# Altium project LT-CHARGE+.PrjPcb
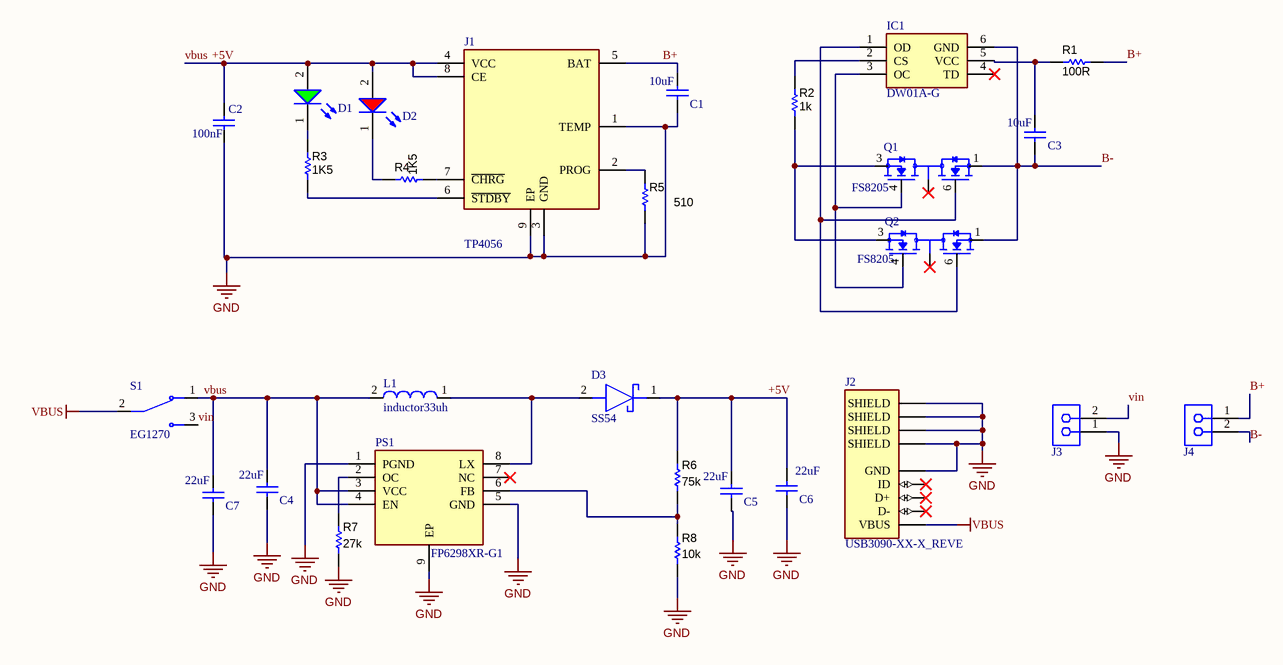
[diagram p0: LT-CHARGE+.SchDoc]
1 sheet, 28 parts. Net scope: global (net labels, ports and power ports of the same name join across sheets).
Board file: LT-CHARGE+.PcbDoc

## Sheet LT-CHARGE+.SchDoc
size A4; SheetNumber: 1; SheetTotal: 1

### Parts
C1  10uF  [WCAP-CSGP_0603_L1.6W0.8H0.8_Wave]
C2  100nF  [WCAP-CSGP_0603_L1.6W0.8H0.8_Wave]
C3  10uF  [WCAP-CSGP_0603_L1.6W0.8H0.8_Wave]
C4  22uF  [WCAP-CSGP_0805_L2W1.25H0.6_Wave]
C5  22uF  [WCAP-CSGP_0805_L2W1.25H0.6_Wave]
C6  22uF  [WCAP-CSGP_0805_L2W1.25H0.6_Wave]
C7  22uF  [WCAP-CSGP_0805_L2W1.25H0.6_Wave]
D1  Green, 3.1V, 120°  [WL-SMCD_0603]  (value not drawn)
D2  Super Red, 2V, 140°  [WL-SMCD_0603]  (value not drawn)
D3  SS54  [DIOM5026X262N]
IC1  DW01A-G  [SOT95P280X135-6N]
J1  TP4056  [SOIC127P600X175-9N]
J2  USB3090-XX-X_REVE  [GCT_USB3080-XX-01-A_REVE]
J3  691412220002M  [691210910002]  (value not drawn)
J4  691412220002M  [MOLEX_530480210]  (value not drawn)
L1  inductor33uh  [WE-PD_6050R]
PS1  FP6298XR-G1  [SOIC127P600X175-9N]
Q1  FS8205  [FS8205]
Q2  FS8205  [FS8205]
R1  ValueDisplayed: 100R  [0603L]  (hidden comment: ERA-3ARW103V)
R2  ValueDisplayed: 1k  [0603L]  (hidden comment: ERA-3ARW103V)
R3  value 1K5  [0402L]  (hidden comment: CRCW0402510RJNED)
R4  value 1K5  [0402L]  (hidden comment: CRCW0402510RJNED)
R5  value 510  [0402L]  (hidden comment: CRCW0402510RJNED)
R6  value 75k  [0402L]  (hidden comment: CRCW0402510RJNED)
R7  value 27k  [0402L]  (hidden comment: CRCW0402510RJNED)
R8  value 10k  [0402L]  (hidden comment: CRCW0402510RJNED)
S1  EG1270  [SW_EG1270]

### Nets
+5V: C2.2 C4.2 C5.2 C6.2 C7.2 D1.2(A) D2.2(A) D3.1(K) J1.4(VCC) J1.8(CE) J2.1(VBUS) L1.2 PS1.3(VCC) PS1.4(EN) R6.2 S1.1 S1.2  [also labelled VBUS]
GND: C1.1 C2.1 C4.1 C5.1 C6.1 C7.1 J1.1(TEMP) J1.3(GND) J1.9(EP) J2.5(GND) J2.6(SHIELD) J2.7(SHIELD) J2.8(SHIELD) J2.9(SHIELD) J3.1 PS1.1(PGND) PS1.5(GND) PS1.9(EP) R5.1 R7.1 R8.1
B+: C1.2 J1.5(BAT) J4.1 R1.2
B-: C3.1 IC1.6(GND) J4.2 Q1.1(S1) Q2.1(S1)
vin: J3.2 S1.3
NetC3_2: C3.2 IC1.5(VCC) R1.1
NetD1_1: D1.1(K) R3.2
NetD2_1: D2.1(K) R4.2
NetD3_2: D3.2(A) L1.1 PS1.8(LX)
NetIC1_1: IC1.1(OD) Q1.6(G1) Q2.6(G1)
NetIC1_2: IC1.2(CS) R2.2
NetIC1_3: IC1.3(OC) Q1.4(G2) Q2.4(G2)
NetJ1_2: J1.2(PROG) R5.2
NetJ1_6: J1.6(~{STDBY}) R3.1
NetJ1_7: J1.7(~{CHRG}) R4.1
NetPS1_2: PS1.2(OC) R7.2
NetPS1_6: PS1.6(FB) R6.1 R8.2
NetQ1_2: Q1.2(D12) Q1.5(D12)
NetQ1_3: Q1.3(S2) Q2.3(S2) R2.1
NetQ2_2: Q2.2(D12) Q2.5(D12)

Not connected (* = marked no-connect by the designer): IC1 4(TD)*; J2 2(D-)* 3(D+)* 4(ID)*; PS1 7(NC)*

### Library data of the parts
C1-C3 = C: WCAP-CSGP Multilayer Ceramic Chip Capacitor, General Purpose, size 0201, NP0 Class I, 100pF, 25VDC; Manufacturer Part Number: 885012004001; Manufacturer: Wurth Elektronik; Case/Size Code: 0201; Capacitance Tolerance: +/-5%; Insulation Resistance: 10GΩ; Q Factor: 1000; Rated Voltage (DC): 25V; Technical Reference: NP00201101J025DFCT10000; Category: Multilayer Ceramic Chip Capacitors; Match Code: WCAP-CSGP; ComponentLink1Description: Website Link; ComponentLink1URL: https://www.we-online.com/redexpert/article/885012004001?ad; ComponentLink2Description: Datasheet Link; ComponentLink2URL: https://www.we-online.com/redexpert/spec/885012004001?ad; Mount: Surface Mount; Operating Temperature Max: 125°C; Operating Temperature Min: -55°C; Packaging: Tape and Reel; Length: 0.6mm; Width: 0.3mm; Height: 0.3mm; Capacitance: 100pF; Ceramic Type: NP0 Class I
C4-C7 = C-08: WCAP-CSGP Multilayer Ceramic Chip Capacitor, General Purpose, size 0201, NP0 Class I, 10pF, 50VDC; Manufacturer Part Number: 885012004011; Manufacturer: Wurth Elektronik; Case/Size Code: 0201; Capacitance Tolerance: +/-5%; Insulation Resistance: 10GΩ; Q Factor: 600; Rated Voltage (DC): 50V; Technical Reference: NP00201100J050DFCT10000; Category: Multilayer Ceramic Chip Capacitors; Match Code: WCAP-CSGP; ComponentLink1Description: Website Link; ComponentLink1URL: https://www.we-online.com/redexpert/article/885012004011?ad; ComponentLink2Description: Datasheet Link; ComponentLink2URL: https://www.we-online.com/redexpert/spec/885012004011?ad; Mount: Surface Mount; Operating Temperature Max: 125°C; Operating Temperature Min: -55°C; Packaging: Tape and Reel; Length: 0.6mm; Width: 0.3mm; Height: 0.3mm; Capacitance: 10pF; Ceramic Type: NP0 Class I
D1 = led-green: WL-SMSW Mono-color Side View Waterclear, size 3014, Green, 3.1V, 120°; Manufacturer Part Number: 155301GS73100; Manufacturer: Wurth Elektronik; Case/Size Code: 3014; Chip Technology: InGaN; Dominant Wavelength: 525nm; Luminous Intensity: 1500mcd; Peak Wavelength: 515nm; Category: Signal LEDs; Match Code: WL-SMSW; ComponentLink1Description: Website Link; ComponentLink1URL: https://www.we-online.com/redexpert/article/155301GS73100?ad; ComponentLink2Description: Datasheet Link; ComponentLink2URL: https://www.we-online.com/redexpert/spec/155301GS73100?ad; Mount: Surface Mount; Operating Temperature Max: 85°C; Operating Temperature Min: -40°C; Packaging: Tape and Reel; Length: 3mm; Width: 1.38mm; Height: 1.55mm; Emitting Color: Green; Forward Voltage: 3.1V; Viewing Angle: 120°
D2 = led-red: WL-SMCD Mono-color Chip LED Diffused, SMT, size 0603, Super Red, 2V, 140°; Manufacturer Part Number: 150060SS55040; Manufacturer: Wurth Elektronik; Case/Size Code: 0603; Chip Technology: AlInGaP; Dominant Wavelength: 630nm; Luminous Intensity: 70mcd; Peak Wavelength: 645nm; Category: Signal LEDs; Match Code: WL-SMCD; ComponentLink1Description: Website Link; ComponentLink1URL: https://www.we-online.com/redexpert/article/150060SS55040?ad; ComponentLink2Description: Datasheet Link; ComponentLink2URL: https://www.we-online.com/redexpert/spec/150060SS55040?ad; Mount: Surface Mount; Operating Temperature Max: 85°C; Operating Temperature Min: -40°C; Packaging: Tape and Reel; Length: 1.6mm; Width: 0.8mm; Height: 0.4mm; Emitting Color: Super Red; Forward Voltage: 2V; Viewing Angle: 140°
D3 = SS54: Schottky Diode; Manufacturer_Name: DIYI Elec Tech; Datasheet Link: https://datasheet.lcsc.com/szlcsc/DIYI-Elec-Tech-SS54_C84165.pdf; Height: 2.62mm; Manufacturer_Part_Number: SS54
IC1 = DW01A-G: Integrated Circuit; Manufacturer_Name: Fortune Semiconductor Corporation; Datasheet Link: http://acoptex.com/uploads/DW01A.pdf; Height: 1.35mm; Manufacturer_Part_Number: DW01A-G
J1 = TP4056: Connector; Manufacturer_Name: NanJing Top Power; Datasheet Link: https://dlnmh9ip6v2uc.cloudfront.net/datasheets/Prototyping/TP4056.pdf; Height: 1.75mm; Manufacturer_Part_Number: TP4056
J2 = USB3090-XX-X_REVE: Micro USB Receptacle, Type AB, SMT, R/A, Bottom Mount, w/out Peg, w/outer shell stakes; Package: None; Price: None; Value: *; MP: USB3090-XX-X_REVE; Availability: Unavailable
J3 = conn: WR-TBL Series 4122M 45° Entry, THT, pitch 7mm, 2p; Manufacturer: Wurth Elektronik; Modularity: No; Rated Current: 4A; Working Voltage: 300V; ComponentLink1Description: Website Link; ComponentLink1URL: https://www.we-online.com/redexpert/article/691412220002M?ad; ComponentLink2Description: Datasheet Link; ComponentLink2URL: https://www.we-online.com/redexpert/spec/691412220002M?ad; Manufacturer Part Number: 691412220002M; Category: Terminal Blocks; Match Code: WR-TBL; Mount: Through Hole; Operating Temperature Max: 120°C; Operating Temperature Min: -30°C; Packaging: Box; Application: Screwless; Number of Pins: 2; Number of Rows: 1; Orientation: 45°; Pitch: 7mm
J4 = header: WR-TBL Series 4122M 45° Entry, THT, pitch 7mm, 2p; Manufacturer: Wurth Elektronik; Modularity: No; Rated Current: 4A; Working Voltage: 300V; ComponentLink1Description: Website Link; ComponentLink1URL: https://www.we-online.com/redexpert/article/691412220002M?ad; ComponentLink2Description: Datasheet Link; ComponentLink2URL: https://www.we-online.com/redexpert/spec/691412220002M?ad; Manufacturer Part Number: 691412220002M; Category: Terminal Blocks; Match Code: WR-TBL; Mount: Through Hole; Operating Temperature Max: 120°C; Operating Temperature Min: -30°C; Packaging: Box; Application: Screwless; Number of Pins: 2; Number of Rows: 1; Orientation: 45°; Pitch: 7mm
L1 = inductor33uh: 33 ÂµH Shielded Drum Core, Wirewound Inductor 3 A 60mOhm Max Nonstandard; MF: Bourns; MP: SRR1260-330M; Value: *; Check_prices: https://www.snapeda.com/parts/SRR1260-330M/Bourns/view-part/?ref=eda; SnapEDA_Link: https://www.snapeda.com/parts/SRR1260-330M/Bourns/view-part/?ref=snap; Availability: Not in stock; Package: Nonstandard Bourns; Price: None
PS1 = FP6298XR-G1: Power Supply; Manufacturer_Name: Feeling Technology; Datasheet Link: https://datasheet.lcsc.com/szlcsc/1811141821_Feeling-Tech-FP6298XR-G1_C88319.pdf; Height: 1.752mm; Manufacturer_Part_Number: FP6298XR-G1
Q1 Q2 = FS8205: Dual N-Channel Enhancement Mode Power MOSFET; MF: Fortune Semiconductor; SnapEDA_Link: https://www.snapeda.com/parts/FS8205/Fortune+Semiconductor/view-part/?ref=snap; Package: Package; MP: FS8205; Check_prices: https://www.snapeda.com/parts/FS8205/Fortune+Semiconductor/view-part/?ref=eda; Price: None; Value: *; Availability: Not in stock
R1 R2 = RES-10K-0603: RES, 10.0 k, 0.05%, 0.1 W, AEC-Q200 Grade 0, 0603; Manufacturer: Panasonic; Res_ohm: 10k; CompType: Resistor; Value: 10.0k; SizeY_mm: 0.8; SizeArea_mm2: 1.28; SizeAreaWB_mm2: 4.68; AEC Grade: 0; Power_W: 100mW; SizeX_mm: 1.6; Value2: 0.1W; Value_Code: 10k0; SizeZ_mm: 1; AEC Qualified: Y; AEC Category: Q200; TempCo: 10 ppm/C; ComponentLink1URL: https://industrial.panasonic.com/cdbs/www-data/pdf/RDM0000/AOA0000C307.pdf; Value1: 0.05%; RoHS: Y; MountType: SMT; PartNumber: ERA-3ARW103V; PackageReference: 0603; ComponentLink1Description: Datasheet link; Tolerance_%: 0.05%; Technology: Thin Film
R3 R4 R6-R8 = CRCW0402510RJNED: RES, 510, 5%, 0.063 W, 0402; Manufacturer: Vishay-Dale; CompType: Resistor; Res_ohm: 510; Value_Code: 510R; Tolerance_%: 5; Power_W: 0.063; Value2: 0.063W; VDC_V: 50; TempCo: 200 ppm/C; EIA_Code: E24; U/M: EA; SymbolVersion: 2009-05-29; PartNumber: CRCW0402510RJNED; PackageReference: 0402; RoHS: Y; Value1: 5%; MountType: SMT; Technology: Thick Film; Published: 2008-06-26; Publisher: Texas Instruments; LatestRevisionDate: 2015-05-27; ComponentLink1Description: Datasheet link; ComponentLink1URL: http://www.vishay.com/docs/20035/dcrcwe3.pdf; Supplier 1: Digi-Key; Supplier Part Number 1: 541-510JCT-ND; Supplier 2: Mouser; Supplier Part Number 2: 71-CRCW0402J-510-E3; Supplier 3: Farnell; Supplier Part Number 3: 1570682; ValueDisplayed: 510
R5 = CRCW0402510RJNED: RES, 510, 5%, 0.063 W, 0402; Manufacturer: Vishay-Dale; CompType: Resistor; Value_Code: 510R; Tolerance_%: 5; Power_W: 0.063; Value2: 0.063W; VDC_V: 50; TempCo: 200 ppm/C; EIA_Code: E24; U/M: EA; SymbolVersion: 2009-05-29; PartNumber: CRCW0402510RJNED; PackageReference: 0402; RoHS: Y; Res_ohm: 510; Value1: 5%; MountType: SMT; Technology: Thick Film; Published: 2008-06-26; Publisher: Texas Instruments; LatestRevisionDate: 2015-05-27; ComponentLink1Description: Datasheet link; ComponentLink1URL: http://www.vishay.com/docs/20035/dcrcwe3.pdf; Supplier 1: Digi-Key; Supplier Part Number 1: 541-510JCT-ND; Supplier 2: Mouser; Supplier Part Number 2: 71-CRCW0402J-510-E3; Supplier 3: Farnell; Supplier Part Number 3: 1570682; ValueDisplayed: 510
S1 = EG1270: Slide Switch SPDT Through Hole, Right Angle; MF: E-Switch; Availability: In Stock; Check_prices: https://www.snapeda.com/parts/EG1270/E-Switch/view-part/?ref=eda; SnapEDA_Link: https://www.snapeda.com/parts/EG1270/E-Switch/view-part/?ref=snap; Purchase-URL: https://pricing.snapeda.com/search/part/EG1270/?ref=eda; Package: None; MP: EG1270; Value: *; Price: None